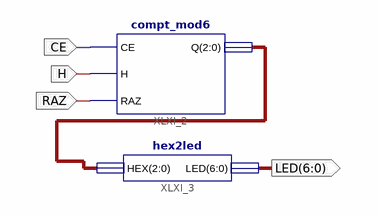
[diagram p0: schematic sheet 1]
// Xilinx ISE schematic TP3.sch (artix7) as structural Verilog: 2 symbols, 4 ports
module TP3 (
  input  CE,
  input  H,
  input  RAZ,
  output [6:0] LED
);

  wire [2:0] Q;

  compt_mod6 XLXI_2 (.CE(CE), .H(H), .Q(Q), .RAZ(RAZ));
  hex2led XLXI_3 (.HEX(Q), .LED(LED));
endmodule
